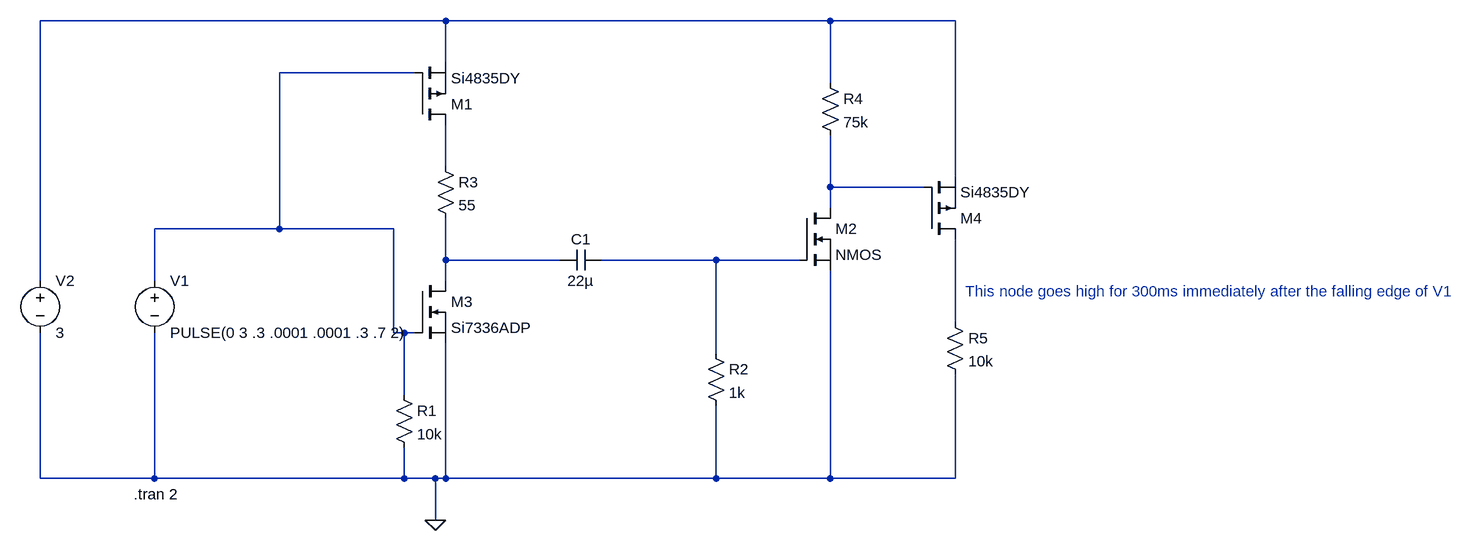
[diagram p0: schematic FallingEdgeTrigger.asc]
FallingEdgeTrigger.asc, the LTspice schematic file:
Version 4
SHEET 1 1980 680
WIRE 384 -288 -240 -288
WIRE 976 -288 384 -288
WIRE 1168 -288 976 -288
WIRE 384 -224 384 -288
WIRE 336 -208 128 -208
WIRE 976 -192 976 -288
WIRE 384 -64 384 -128
WIRE 1168 -48 1168 -288
WIRE 976 -32 976 -112
WIRE 1120 -32 976 -32
WIRE 976 0 976 -32
WIRE 128 32 128 -208
WIRE 128 32 -64 32
WIRE 304 32 128 32
WIRE 384 80 384 16
WIRE 560 80 384 80
WIRE 800 80 624 80
WIRE 928 80 800 80
WIRE -240 112 -240 -288
WIRE -64 112 -64 32
WIRE 384 112 384 80
WIRE 1168 176 1168 48
WIRE 304 192 304 32
WIRE 320 192 304 192
WIRE 336 192 320 192
WIRE 800 224 800 80
WIRE 320 288 320 192
WIRE -240 416 -240 192
WIRE -64 416 -64 192
WIRE -64 416 -240 416
WIRE 320 416 320 368
WIRE 320 416 -64 416
WIRE 368 416 320 416
WIRE 384 416 384 208
WIRE 384 416 368 416
WIRE 800 416 800 304
WIRE 800 416 384 416
WIRE 976 416 976 96
WIRE 976 416 800 416
WIRE 1168 416 1168 256
WIRE 1168 416 976 416
WIRE 368 480 368 416
FLAG 368 480 0
SYMBOL voltage -64 96 R0
WINDOW 123 0 0 Left 2
WINDOW 39 0 0 Left 2
SYMATTR InstName V1
SYMATTR Value PULSE(0 3 .3 .0001 .0001 .3 .7 2)
SYMBOL voltage -240 96 R0
WINDOW 123 0 0 Left 2
WINDOW 39 0 0 Left 2
SYMATTR InstName V2
SYMATTR Value 3
SYMBOL cap 624 64 R90
WINDOW 0 0 32 VBottom 2
WINDOW 3 32 32 VTop 2
SYMATTR InstName C1
SYMATTR Value 22µ
SYMBOL nmos 928 0 R0
SYMATTR InstName M2
SYMBOL res 960 -208 R0
SYMATTR InstName R4
SYMATTR Value 75k
SYMBOL nmos 336 112 R0
SYMATTR InstName M3
SYMATTR Value Si7336ADP
SYMBOL res 304 272 R0
SYMATTR InstName R1
SYMATTR Value 10k
SYMBOL res 784 208 R0
SYMATTR InstName R2
SYMATTR Value 1k
SYMBOL res 368 -80 R0
SYMATTR InstName R3
SYMATTR Value 55
SYMBOL pmos 336 -128 M180
SYMATTR InstName M1
SYMATTR Value Si4835DY
SYMBOL pmos 1120 48 M180
SYMATTR InstName M4
SYMATTR Value Si4835DY
SYMBOL res 1152 160 R0
SYMATTR InstName R5
SYMATTR Value 10k
TEXT -96 440 Left 2 !.tran 2
TEXT 1184 128 Left 2 ;This node goes high for 300ms immediately after the falling edge of V1

The netlist it stands for:
* FallingEdgeTrigger.asc
V1 N002 0 PULSE(0 3 .3 .0001 .0001 .3 .7 2)
V2 N001 0 3
C1 N006 N005 22µ
M2 N004 N006 0 0 NMOS
R4 N001 N004 75k
M3 N005 N002 0 0 Si7336ADP
R1 N002 0 10k
R2 N006 0 1k
R3 N003 N005 55
M1 N003 N002 N001 N001 Si4835DY
M4 N007 N004 N001 N001 Si4835DY
R5 N007 0 10k
.model NMOS NMOS
.model PMOS PMOS
.lib standard.mos
.tran 2
* This node goes high for 300ms immediately after the falling edge of V1
.backanno
.end